# Altium project ADC_Project.PrjPcb
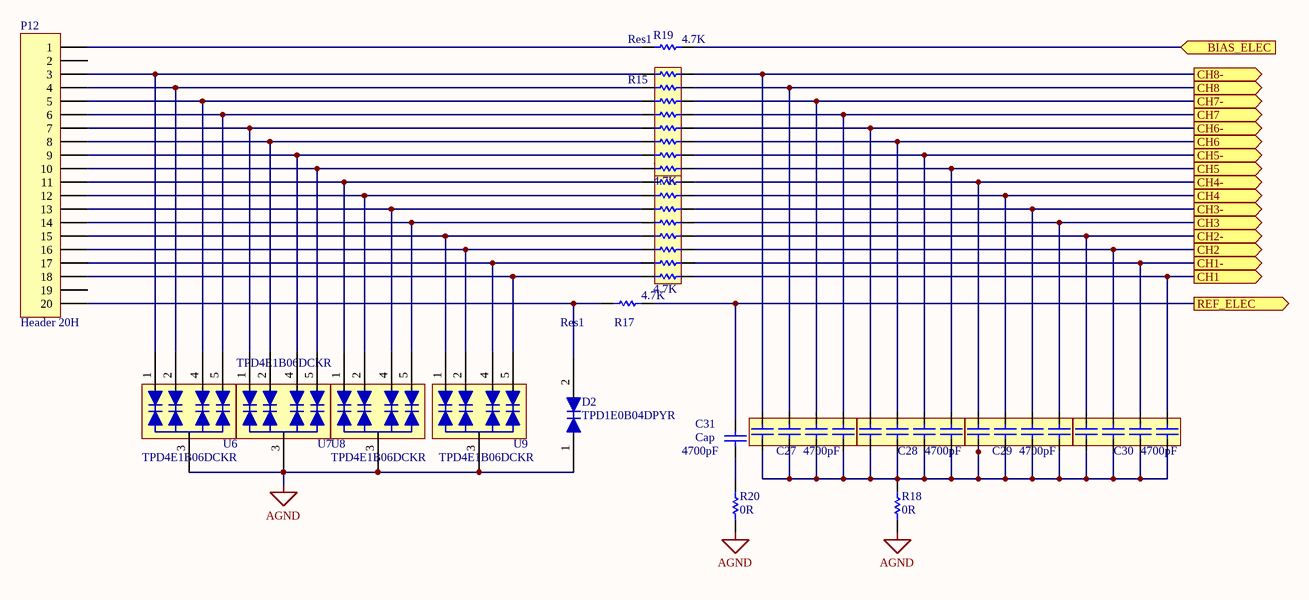
[diagram p0: elec.SchDoc]
1 sheet, 17 parts. Net scope: flat (ports and power ports of the same name join across sheets).
Board file: PCB_ADC.PcbDoc

## Sheet elec.SchDoc: Electrodes Interface
size A4; DrawnBy: Zheng; DocumentNumber: 4; Revision: 3; SheetNumber: 4; SheetTotal: 4

### Parts
C27  Capacitance: 4700pF  [1206C-ARRAY]  (hidden comment: 50V)
C28  Capacitance: 4700pF  [1206C-ARRAY]  (hidden comment: 50V)
C29  Capacitance: 4700pF  [1206C-ARRAY]  (hidden comment: 50V)
C30  Capacitance: 4700pF  [1206C-ARRAY]  (hidden comment: 50V)
C31  Cap  value 4700pF  [0402C]
D2  TPD1E0B04DPYR  [0402D]
P12  Header 20H  [HDR1X20H]
R15  Resistance: 4.7K  [1506R]  (hidden comment: RES 8X)
R16  Resistance: 4.7K  [1506R]  (hidden comment: RES 8X)
R17  Res1  value 4.7K  [0603]
R18  Resistance (Ohms): 0R  [0603]  (hidden comment: Res 0805)
R19  Res1  value 4.7K  [0603]
R20  Resistance (Ohms): 0R  [0603]  (hidden comment: Res 0805)
U6  TPD4E1B06DCKR  [DCK6_TEX]
U7  TPD4E1B06DCKR  [DCK6_TEX]
U8  TPD4E1B06DCKR  [DCK6_TEX]
U9  TPD4E1B06DCKR  [DCK6_TEX]

### Ports
BIAS_ELEC (in), CH1 (out), CH1- (out), CH2 (out), CH2- (out), CH3 (out), CH3- (out), CH4 (out), CH4- (out), CH5 (out), CH5- (out), CH6 (out), CH6- (out), CH7 (out), CH7- (out), CH8 (out), CH8- (out), REF_ELEC (out)

### Nets
AGND: D2.1(IO1) R18.1 R20.1 U6.3(GND) U7.3(GND) U8.3(GND) U9.3(GND)
NetC27_A1: C27.A1 R15.B1 ; port CH8-
NetC27_A2: C27.A2 R15.B2 ; port CH8
NetC27_A3: C27.A3 R15.B3 ; port CH7-
NetC27_A4: C27.A4 R15.B4 ; port CH7
NetC27_B1: C27.B1 C27.B2 C27.B3 C27.B4 C28.B1 C28.B2 C28.B3 C28.B4 C29.B1 C29.B2 C29.B3 C29.B4 C30.B1 C30.B2 C30.B3 C30.B4 R18.2
NetC28_A1: C28.A1 R15.B5 ; port CH6-
NetC28_A2: C28.A2 R15.B6 ; port CH6
NetC28_A3: C28.A3 R15.B7 ; port CH5-
NetC28_A4: C28.A4 R15.B8 ; port CH5
NetC29_A1: C29.A1 R16.B1 ; port CH4-
NetC29_A2: C29.A2 R16.B2 ; port CH4
NetC29_A3: C29.A3 R16.B3 ; port CH3-
NetC29_A4: C29.A4 R16.B4 ; port CH3
NetC30_A1: C30.A1 R16.B5 ; port CH2-
NetC30_A2: C30.A2 R16.B6 ; port CH2
NetC30_A3: C30.A3 R16.B7 ; port CH1-
NetC30_A4: C30.A4 R16.B8 ; port CH1
NetC31_1: C31.1 R20.2
NetC31_2: C31.2 R17.2 ; port REF_ELEC
NetD2_2: D2.2(GND) P12.20 R17.1
NetP12_1: P12.1 R19.1
NetP12_3: P12.3 R15.A1 U6.1(IO1)
NetP12_4: P12.4 R15.A2 U6.2(IO2)
NetP12_5: P12.5 R15.A3 U6.4(IO3)
NetP12_6: P12.6 R15.A4 U6.5(IO4)
NetP12_7: P12.7 R15.A5 U7.1(IO1)
NetP12_8: P12.8 R15.A6 U7.2(IO2)
NetP12_9: P12.9 R15.A7 U7.4(IO3)
NetP12_10: P12.10 R15.A8 U7.5(IO4)
NetP12_11: P12.11 R16.A1 U8.1(IO1)
NetP12_12: P12.12 R16.A2 U8.2(IO2)
NetP12_13: P12.13 R16.A3 U8.4(IO3)
NetP12_14: P12.14 R16.A4 U8.5(IO4)
NetP12_15: P12.15 R16.A5 U9.1(IO1)
NetP12_16: P12.16 R16.A6 U9.2(IO2)
NetP12_17: P12.17 R16.A7 U9.4(IO3)
NetP12_18: P12.18 R16.A8 U9.5(IO4)
NetR19_2: R19.2 ; port BIAS_ELEC

Not connected (* = marked no-connect by the designer): P12 2 19

### Library data of the parts
C27-C30 = Cap: CAP .1UF 50V CERAMIC Y5V 0805; Manufacturer: TDK; PCN Part Number: MLCC Part Number Change 30/Nov/2012; Manufacturer Part Number: CKCA43X7R1H472M100AA; Description1: Cap Ceramic Array 0.0047uF 50V X7R 20% 1206 SMD 4 Capacitor 125C Plastic T/R; Product Training Modules: CKC Series Array Capacitor Family; Catalog Drawings: CKC 1206 Series CKC 1206 Series Footprint; Featured Product: CKC Series; Tolerance: ±20%; Number of Capacitors: 4; Circuit Type: Isolated; Temperature Coefficient: X7R; Other Names: 445-1853-1; Revision: July-2002: Re-released for DXP Platform.; Supplier 1: Digi-Key; Supplier Part Number 1: 445-1853-1-ND; Stock 1: 155348; Pricing 1: 1=0.33, 10=0.228, 100=0.129, 500=0.0911, 1000=0.0797 (USD); RoHS Information: RoHS Certificate-MLCC; Standard Package: 1; Category: Capacitors; Family: Capacitor Arrays; Series: CKC; Packaging: Cut Tape (CT); Voltage - Rated: 50V; Dielectric Material: Ceramic; Mounting Type: Surface Mount; Package / Case: 1206 (3216 Metric); Size / Dimension: 0.126" L x 0.063" W (3.20mm x 1.60mm); Height - Seated (Max): 0.051" (1.30mm); Ratings: -; Online Catalog: CKC Series; ComponentLink1URL: https://datasheet.ciiva.com/7615/mlccspec-commercial-array-en-7615142.pdf; ComponentLink1Description: https://datasheet.ciiva.com/7615/mlccspec-commercial-array-en-7615142.pdf; ComponentLink2URL: https://datasheet.ciiva.com/7615/mlccspec-commercial-array-en-7615147.pdf; ComponentLink2Description: https://datasheet.ciiva.com/7615/mlccspec-commercial-array-en-7615147.pdf; ComponentLink3URL: https://datasheet.ciiva.com/7615/mlccspec-commercial-array-en-7615148.pdf; ComponentLink3Description: https://datasheet.ciiva.com/7615/mlccspec-commercial-array-en-7615148.pdf; ComponentLink4URL: https://datasheet.ciiva.com/24216/ckca43x7r1h472m100aa-266209-24216735.pdf; ComponentLink4Description: https://datasheet.ciiva.com/24216/ckca43x7r1h472m100aa-266209-24216735.pdf
C31 = Cap: Capacitor; Published: 8-Jun-2000; LatestRevisionDate: 17-Jul-2002; LatestRevisionNote: Re-released for DXP Platform.; PackageReference: RAD-0.3; Publisher: Altium Limited; PackageDescription: Radial Cap, Thru-Hole; 2 Leads; 0.3 in Pin Spacing
D2 = TPD1E0B04DPYR: Manufacturer: Texas Instruments; Supplier 1: Digi-Key; Supplier Part Number 1: 296-47864-1-ND; Stock 1: 6850; Pricing 1: 1=0.43, 10=0.346, 100=0.2353, 500=0.1765, 1000=0.1324 (USD); Manufacturer Part Number: TPD1E0B04DPYR
P12 = Header 20H: Header, 20-Pin, Right Angle; LatestRevisionDate: 17-Jul-2002; LatestRevisionNote: Re-released for DXP Platform.; Publisher: Altium Limited
R15 R16 = RES 8X: Resistor; Manufacturer: Panasonic; Manufacturer Part Number: EXB-2HV472JV; Description1: Res Thick Film Array 4.7K Ohm 5% 1/4W ±200ppm/°C ISOL 16-Pin 1506(8 X 0402) Convex SMD Punched Carrier T/R; No of Elements: 8; Tolerance (%): ±5 %; Power Dissipation: 0.063 W; Voltage Rating: 50 V; Supplier 1: Digi-Key; Supplier Part Number 1: Y1472CT-ND; Stock 1: 49295; Pricing 1: 1=0.29, 10=0.248, 25=0.1804, 50=0.1308, 100=0.097, 250=0.0744, 500=0.0586, 1000=0.0406 (USD); Case Size: 0402 (1005 Metric); ComponentLink1URL: https://datasheet.ciiva.com/19466/1387876-19466987.pdf; ComponentLink1Description: https://datasheet.ciiva.com/19466/1387876-19466987.pdf; ComponentLink2URL: https://datasheet.ciiva.com/28636/1790599-28636958.pdf; ComponentLink2Description: https://datasheet.ciiva.com/28636/1790599-28636958.pdf; ComponentLink3URL: https://datasheet.ciiva.com/30089/aoc0000ce1-30089086.pdf; ComponentLink3Description: https://datasheet.ciiva.com/30089/aoc0000ce1-30089086.pdf
R17 R19 = Res1: Resistor; Published: 8-Jun-2000; LatestRevisionDate: 17-Jul-2002; LatestRevisionNote: Re-released for DXP Platform.; PackageReference: AXIAL-0.3; Publisher: Altium Limited; PackageDescription: Axial Device, Thru-Hole; 2 Leads; 0.3 in Pin Spacing
R18 R20 = Res 0805: Resistor; Manufacturer: Panasonic; Manufacturer Part Number: ERJ-2GE0R00X; Description1: Res Thick Film 0402 0 Ohm Molded SMD Automotive T/R; EDA / CAD Models: Download from Accelerated Designs; Tolerance: Jumper; Power (Watts): 0.1W, 1/10W; Online Catalog: ERJ Series; Other Names: P0.0JDKR; Supplier 1: Digi-Key; Supplier Part Number 1: P0.0JCT-ND; Stock 1: 31263960; Pricing 1: 1=0.1, 10=0.037, 25=0.0268, 50=0.0204, 100=0.015, 250=0.0114, 500=0.0091, 1000=0.0067, 5000=0.0048 (USD); Standard Package: 1; Category: Resistors; Family: Chip Resistor - Surface Mount; Series: ERJ; Packaging: Digi-Reel®; Composition: Thick Film; Features: Automotive AEC-Q200; Temperature Coefficient: -; Operating Temperature: -55°C ~ 155°C; Package / Case: 0402 (1005 Metric); Supplier Device Package: 0402; Size / Dimension: 0.039" L x 0.020" W (1.00mm x 0.50mm); Height: 0.016" (0.40mm); Number of Terminations: 2; ComponentLink1URL: https://datasheet.ciiva.com/48531/aoa0000ce1-48531077.pdf; ComponentLink1Description: https://datasheet.ciiva.com/48531/aoa0000ce1-48531077.pdf; ComponentLink2URL: https://datasheet.ciiva.com/16783/70260739-16783734.pdf; ComponentLink2Description: https://datasheet.ciiva.com/16783/70260739-16783734.pdf; ComponentLink3URL: https://datasheet.ciiva.com/11821/0900766b80f806dd-11821176.pdf; ComponentLink3Description: https://datasheet.ciiva.com/11821/0900766b80f806dd-11821176.pdf; ComponentLink4URL: https://datasheet.ciiva.com/17215/aoa0000ce1-17215386.pdf; ComponentLink4Description: https://datasheet.ciiva.com/17215/aoa0000ce1-17215386.pdf; ComponentLink5URL: https://datasheet.ciiva.com/43460/1678796-43460347.pdf; ComponentLink5Description: https://datasheet.ciiva.com/43460/1678796-43460347.pdf; ComponentLink6URL: https://datasheet.ciiva.com/5959/1678796-5959692.pdf; ComponentLink6Description: https://datasheet.ciiva.com/5959/1678796-5959692.pdf; ComponentLink7URL: https://datasheet.ciiva.com/30097/4aoa0000ce1-30097116.pdf; ComponentLink7Description: https://datasheet.ciiva.com/30097/4aoa0000ce1-30097116.pdf; ComponentLink8URL: https://datasheet.ciiva.com/28695/1678796-28695758.pdf; ComponentLink8Description: https://datasheet.ciiva.com/28695/1678796-28695758.pdf; ComponentLink9URL: https://datasheet.ciiva.com/46389/1678796-46389518.pdf; ComponentLink9Description: https://datasheet.ciiva.com/46389/1678796-46389518.pdf; ComponentLink10URL: https://datasheet.ciiva.com/16778/70260739-16778335.pdf; ComponentLink10Description: https://datasheet.ciiva.com/16778/70260739-16778335.pdf
U6-U9 = TPD4E1B06DCKR: Manufacturer: Texas Instruments; Description1: TVS DIODE 5.5VWM 14.5VC SC70-6; Direction Type: Uni-Directional; Maximum Clamping Voltage: 15(Typ) V; Number of Elements per Chip: 4; ESD Protection Voltage: ±18@Air Gap/±18@Contact Disc kV; Maximum Working Voltage: 5.5 V; Maximum Leakage Current: 0.01 uA; Capacitance Value: 1 pF; Supplier 1: Digi-Key; Supplier Part Number 1: 296-39346-1-ND; Stock 1: 120901; Pricing 1: 1=0.61, 10=0.519, 100=0.3876, 500=0.3046, 1000=0.2353 (USD); Type: Diode Arrays; Pin Count: 6; Minimum Operating Temperature: -40 °C; Maximum Operating Temperature: 125 °C; Mounting: Surface Mount; Category: ESD Suppressors; ComponentLink1URL: https://datasheet.ciiva.com/12545/tpd4e1b06-224687-12545147.pdf; ComponentLink1Description: https://datasheet.ciiva.com/12545/tpd4e1b06-224687-12545147.pdf; ComponentLink2URL: https://datasheet.ciiva.com/6574/tpd4e1b06-6574671.pdf; ComponentLink2Description: https://datasheet.ciiva.com/6574/tpd4e1b06-6574671.pdf; Manufacturer Part Number: TPD4E1B06DCKR